# Altium schematic sheet 2_MCU.SchDoc
size 420 x 297 mm; Author: Ivanchenko Andrii; SheetNumber: 2; SheetTotal: 3; Rozrobyv: Іванченко А.; Pereviryv: {Перевірив}; Tkontr: {Т.контр}; Nkontr: {Н. контр.}; Zatverdyv: {Затвердив}; Oboznachennia: РІ91.468789.001 Е3; Naymenuvannya: Генератор прямого; Naymenuvannya2: цифрового синтезу; MisceVudannya: НТУУ КПІ, РТФ, РІ-91; Naymenuvannya3: Схема електрична принципова; Sheet: 2
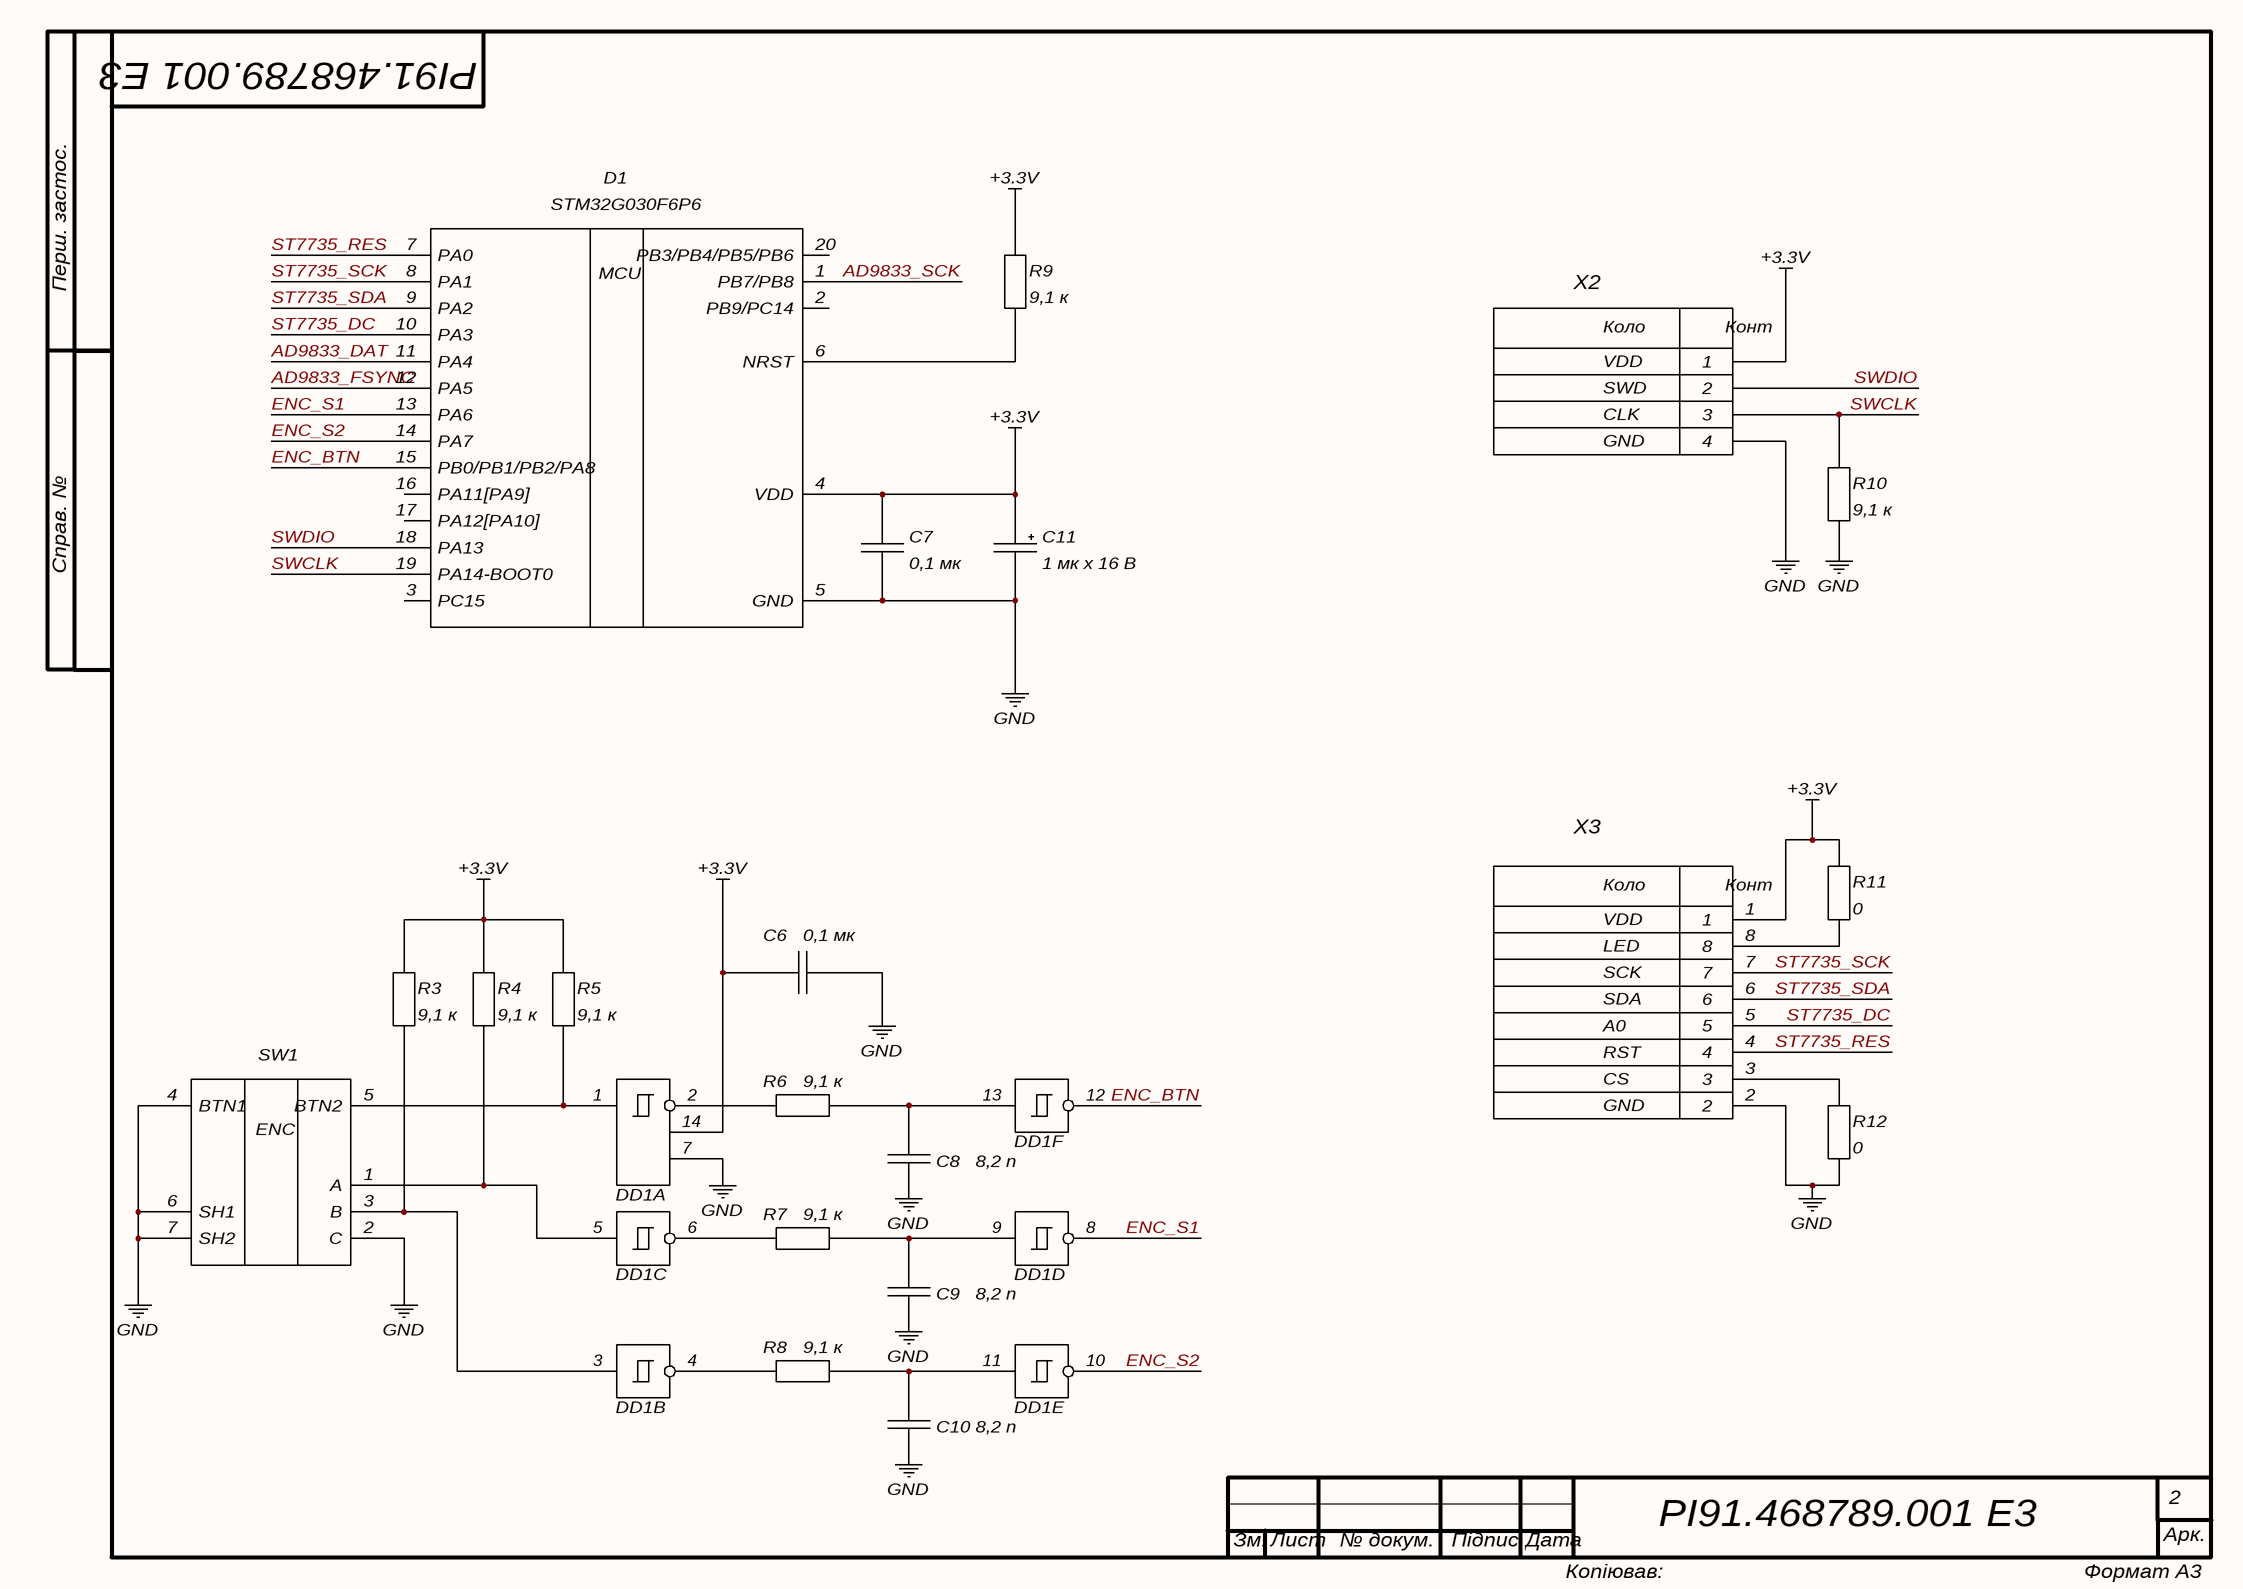
[diagram p0: 2_MCU.SchDoc]

## Parts
C6  0.1u  [CAP: 0603]  (value not drawn)
C7  0.1u  [CAP: 0603]  (value not drawn)
C8  8.2p  [CAP: 0603]  (value not drawn)
C9  8.2p  [CAP: 0603]  (value not drawn)
C10  8.2p  [CAP: 0603]  (value not drawn)
C11  1 16: 1 мк х 16 В  [CAP: TANTAL-A]  (hidden comment: 1u 16V)
D1  STM32G030F6P6  [20-TSSOP]
DD1  SN74HC14  [14-SOIC]  (value not drawn)  (parts A,B,C,D,E,F of 6)
R3  9.1k  [RES: 0603]  (value not drawn)
R4  9.1k  [RES: 0603]  (value not drawn)
R5  9.1k  [RES: 0603]  (value not drawn)
R6  9.1k  [RES: 0603]  (value not drawn)
R7  9.1k  [RES: 0603]  (value not drawn)
R8  9.1k  [RES: 0603]  (value not drawn)
R9  9.1k  [RES: 0603]  (value not drawn)
R10  9.1k  [RES: 0603]  (value not drawn)
R11  0  [RES: 0603]
R12  0  [RES: 0603]
SW1  EC11  [ENC: EC11]  (value not drawn)
X2  IDC-10MS  [CON: IDC-10MS]  (value not drawn)
X3  ST7735 display  [TFT: 1.8 DISPLAY]  (value not drawn)

## Nets
+3.3V: C6.2 C7.2 C11.1 D1.4(VDD) DD1.14(VCC) R3.2 R4.2 R5.2 R9.2 R11.1 X2.3(1) X3.1
GND: C6.1 C7.1 C8.1 C9.1 C10.1 C11.2 D1.5(GND) DD1.7(GND) R10.1 R12.2 SW1.2(C) SW1.4(BTN1) SW1.6(SH1) SW1.7(SH2) X2.7(4) X3.2
AD9833_DAT: D1.11(PA4)
AD9833_FSYNC: D1.12(PA5)
AD9833_SCK: D1.1(PB7/PB8)
ENC_BTN: D1.15(PB0/PB1/PB2/PA8) DD1.12
ENC_S1: D1.13(PA6) DD1.8
ENC_S2: D1.14(PA7) DD1.10
ST7735_DC: D1.10(PA3) X3.5
ST7735_RES: D1.7(PA0) X3.4
ST7735_SCK: D1.8(PA1) X3.7
ST7735_SDA: D1.9(PA2) X3.6
SWCLK: D1.19(PA14-BOOT0) R10.2 X2.5(3)
SWDIO: D1.18(PA13) X2.9(2)
NetC8_2: C8.2 DD1.13 R6.2
NetC9_2: C9.2 DD1.9 R7.2
NetC10_2: C10.2 DD1.11 R8.2
NetD1_6: D1.6(NRST) R9.1
NetDD1_1: DD1.1 R5.1 SW1.5(BTN2)
NetDD1_2: DD1.2 R6.1
NetDD1_3: DD1.3 R3.1 SW1.3(B)
NetDD1_4: DD1.4 R8.1
NetDD1_5: DD1.5 R4.1 SW1.1(A)
NetDD1_6: DD1.6 R7.1
NetR11_2: R11.2 X3.8
NetR12_1: R12.1 X3.3

Not connected (* = marked no-connect by the designer): D1 2(PB9/PC14) 3(PC15) 16(PA11[PA9]) 17(PA12[PA10]) 20(PB3/PB4/PB5/PB6)

## Notes on the sheet
- Перш. застос.
- Справ. №
- Арк.
- Зм.
- Лист
- № докум.
- Підпис
- Дата
- Копіював:
- Формат А3
- (in symbol Connector Display) Коло; Конт; VDD; LED; SCK; SDA; A0; RST; CS; GND
- (in symbol Connector SWD) Коло; Конт; VDD; SWD; CLK; GND
- (in symbol Encoder) ENC

## Library data of the parts
C6-C10 = Capacitor: Non-polarity; 1 мк: 1 мк; 100 н: 100 н; 470 н: 470 н; 8,2 п: 8,2 п; 0,1 мк: 0,1 мк; 10 н: 10 н; 180 п: 180 п; 300 п: 300 п; 330 п: 330 п; 510 п: 510 п; 270 п: 270 п
C11 = Capacitor_polar: Polarity; 470 6,3: 470 мк х 6,3 В; 2200 35: 2200 мк x 35 В; 100 16: 100 мк х 16 В; 0.1 400: 0,1 мк х 400 В; 10 16: 10 мк х 16 В; 2.2 16: 2,2 мк х 16 В; 47 50: 47 мк х 50 В; 47 10: 47 мк х 10 В
D1 = MCU: Manufacturer: STMicroelectronics; ValueManufacturerPartNumber: IC microcontroller, 32-Bit, Cortex-M0+, 64MHz, 32KB, 8KB, 2...3.6V, -40...+85°C, 20-TSSOP; Supply: 2...3.6V; Speed: 64MHz; CoreSize: 32-Bit; MemoryROM: 32KB; MemoryRAM: 8KB; CoreProcessor: Cortex-M0+; HelpURL: https://www.st.com/en/microcontrollers-microprocessors/stm32g030f6.html; Package: 20-TSSOP; ComponentType: IC microcontroller; Temperature: -40...+85°C; PartNumber: STM32G030F6P6
DD1 = SN74HC14: Schmitt trigger; Model: SN74HC14
R3-R12 = Resistor: 220: 220; 1 к: 1 к; 3,3 к: 3,3 к; 9,1 к: 9,1 к; 200: 200; 50: 50; 510 к: 510 к; 10 к: 10 к; 0: 0
SW1 = Encoder: Rotary Encoder
X2 = Connector SWD: SWD Interface
X3 = Connector Display: TFT Display